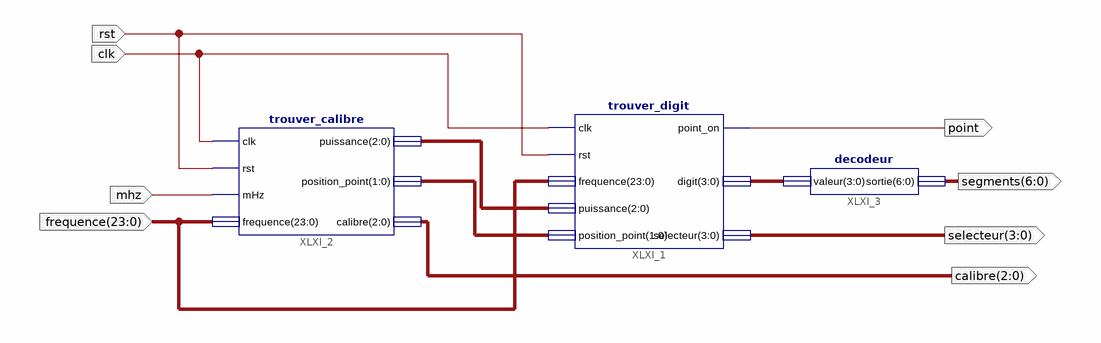
[diagram p0: schematic sheet 1]
// Xilinx ISE schematic afficheur.sch (spartan3e) as structural Verilog: 3 symbols, 8 ports
module afficheur (
  input  clk,
  input  rst,
  input  mhz,
  input  [23:0] frequence,
  output [3:0] selecteur,
  output point,
  output [2:0] calibre,
  output [6:0] segments
);

  wire [1:0] XLXN_2;
  wire [2:0] XLXN_1;
  wire [3:0] XLXN_5;

  trouver_digit XLXI_1 (
    .clk(clk), .rst(rst), .frequence(frequence), .puissance(XLXN_1), .position_point(XLXN_2),
    .point_on(point), .digit(XLXN_5), .selecteur(selecteur));
  trouver_calibre XLXI_2 (
    .clk(clk), .rst(rst), .mHz(mhz), .frequence(frequence), .puissance(XLXN_1), .position_point(XLXN_2),
    .calibre(calibre));
  decodeur XLXI_3 (.valeur(XLXN_5), .sortie(segments));
endmodule
